# EAGLE design expansion_rxtx_rev_b (EAGLE 6.6.0)

## Sheet 1 of 3
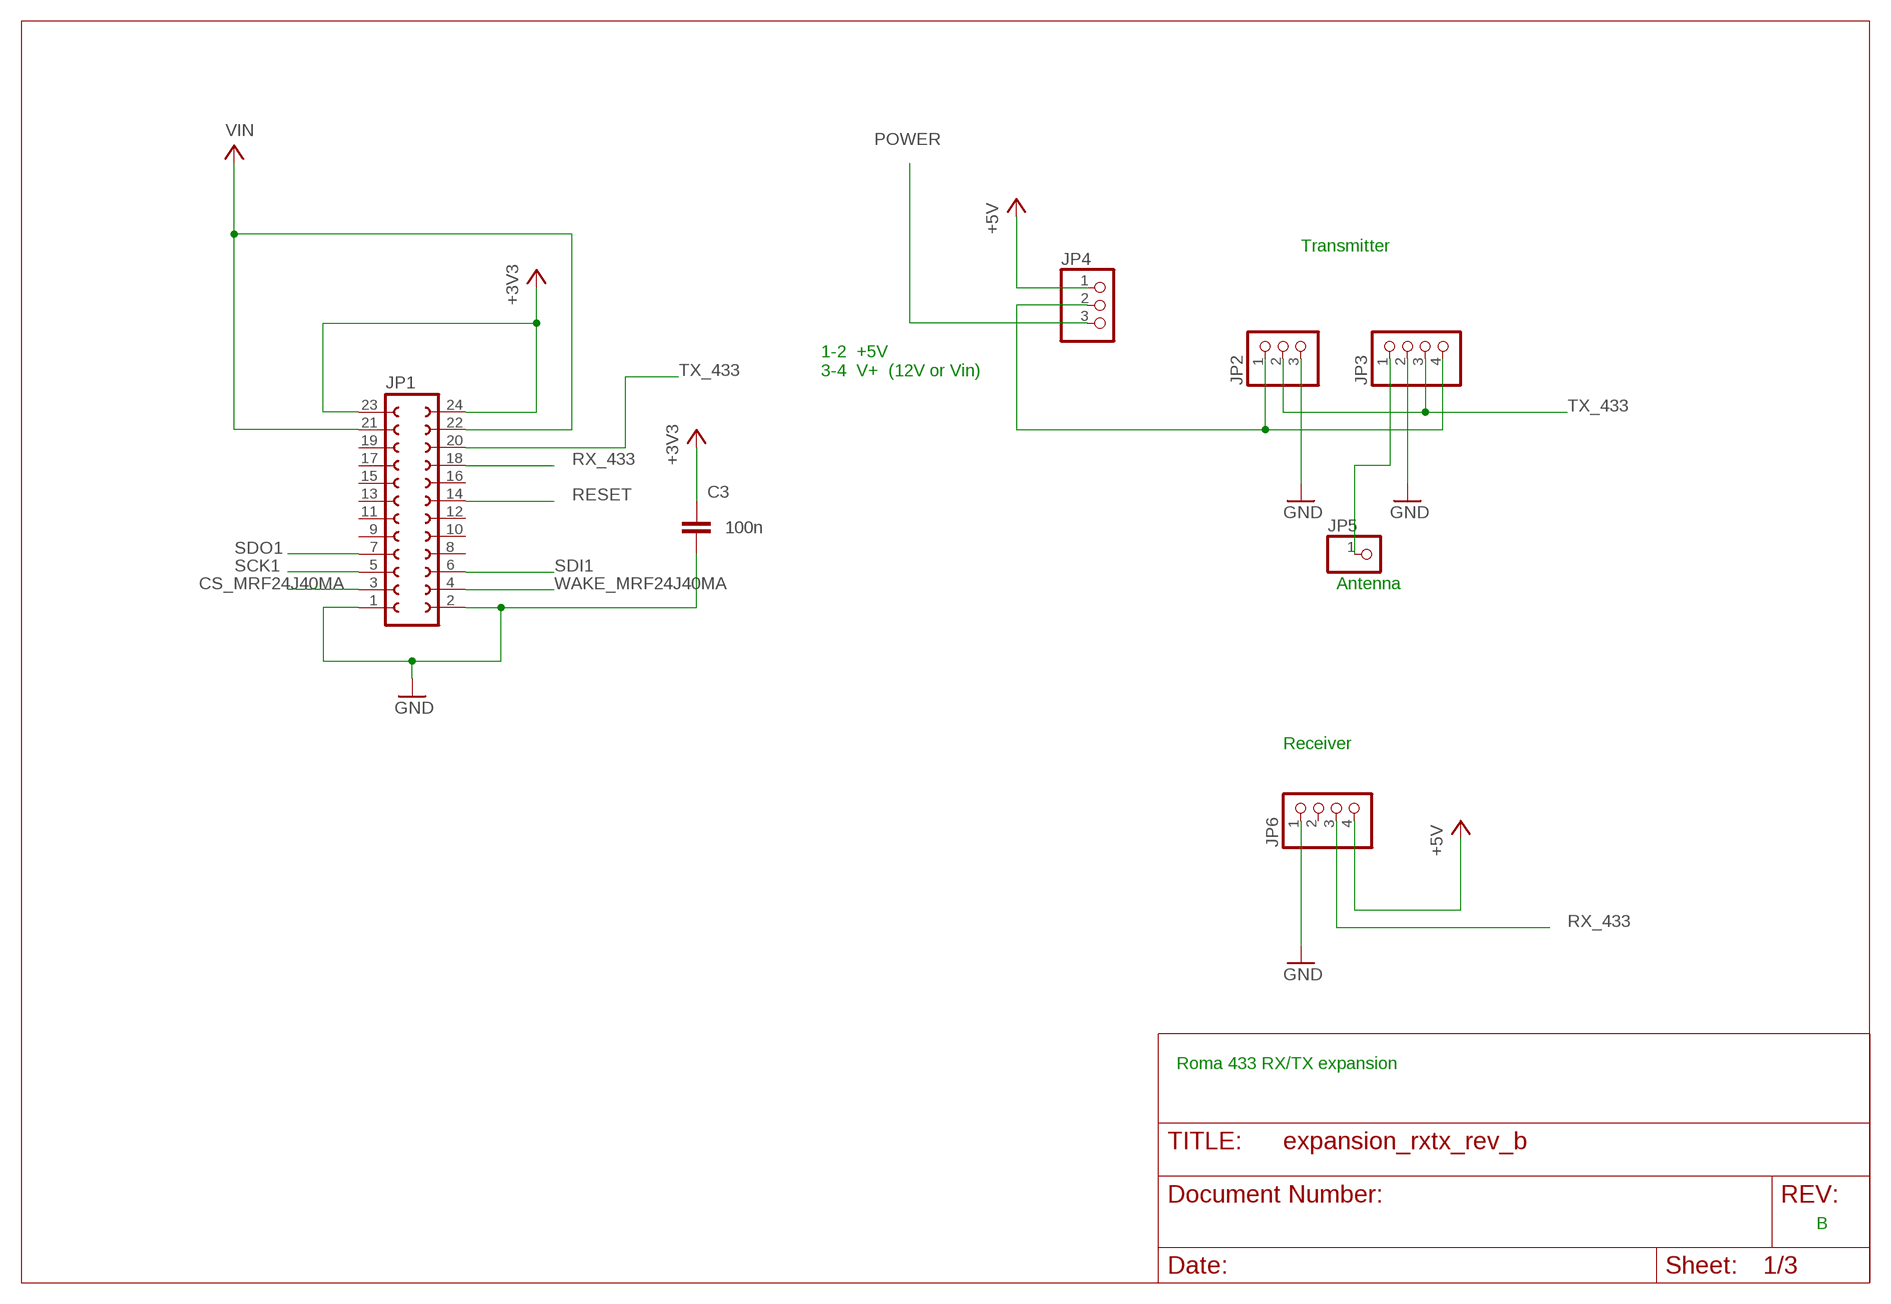
[diagram p0: schematic, sheet 1]

### Parts
C3  100n  C-EUC0805  [C0805]
JP1  FE12-2  [FE12-2]
JP2  PINHD-1X3  [1X03]
JP3  PINHD-1X4  [1X04]
JP4  PINHD-1X3  [1X03]
JP5  PINHD-1X1  [1X01]
JP6  PINHD-1X4  [1X04]

### Nets
+3V3: C3.1 JP1.23 JP1.24 ; also sheet 2,3
+5V: JP4.1 JP6.4 ; also sheet 2
CS_MRF24J40MA: JP1.3 ; also sheet 3
GND: C3.2 JP1.1 JP1.2 JP2.3 JP3.2 JP6.1 ; also sheet 2,3
N$4: JP2.1 JP3.4 JP4.2
N$33: JP3.1 JP5.1
POWER: JP4.3 ; also sheet 2
RESET: JP1.14 ; also sheet 3
RX_433: JP1.18 JP6.3 ; also sheet 3
SCK1: JP1.5 ; also sheet 3
SDI1: JP1.6 ; also sheet 3
SDO1: JP1.7 ; also sheet 3
TX_433: JP1.20 JP2.2 JP3.3
VIN: JP1.21 JP1.22 ; also sheet 2
WAKE_MRF24J40MA: JP1.4 ; also sheet 3
Unconnected: JP1.8 JP1.9 JP1.10 JP1.11 JP1.12 JP1.13 JP1.15 JP1.16 JP1.17 JP1.19 JP6.2

### Notes on the sheet
- Transmitter
- 1-2  +5V
  3-4  V+  (12V or Vin)
- Antenna
- Receiver
- Roma 433 RX/TX expansion
- B

## Sheet 2 of 3
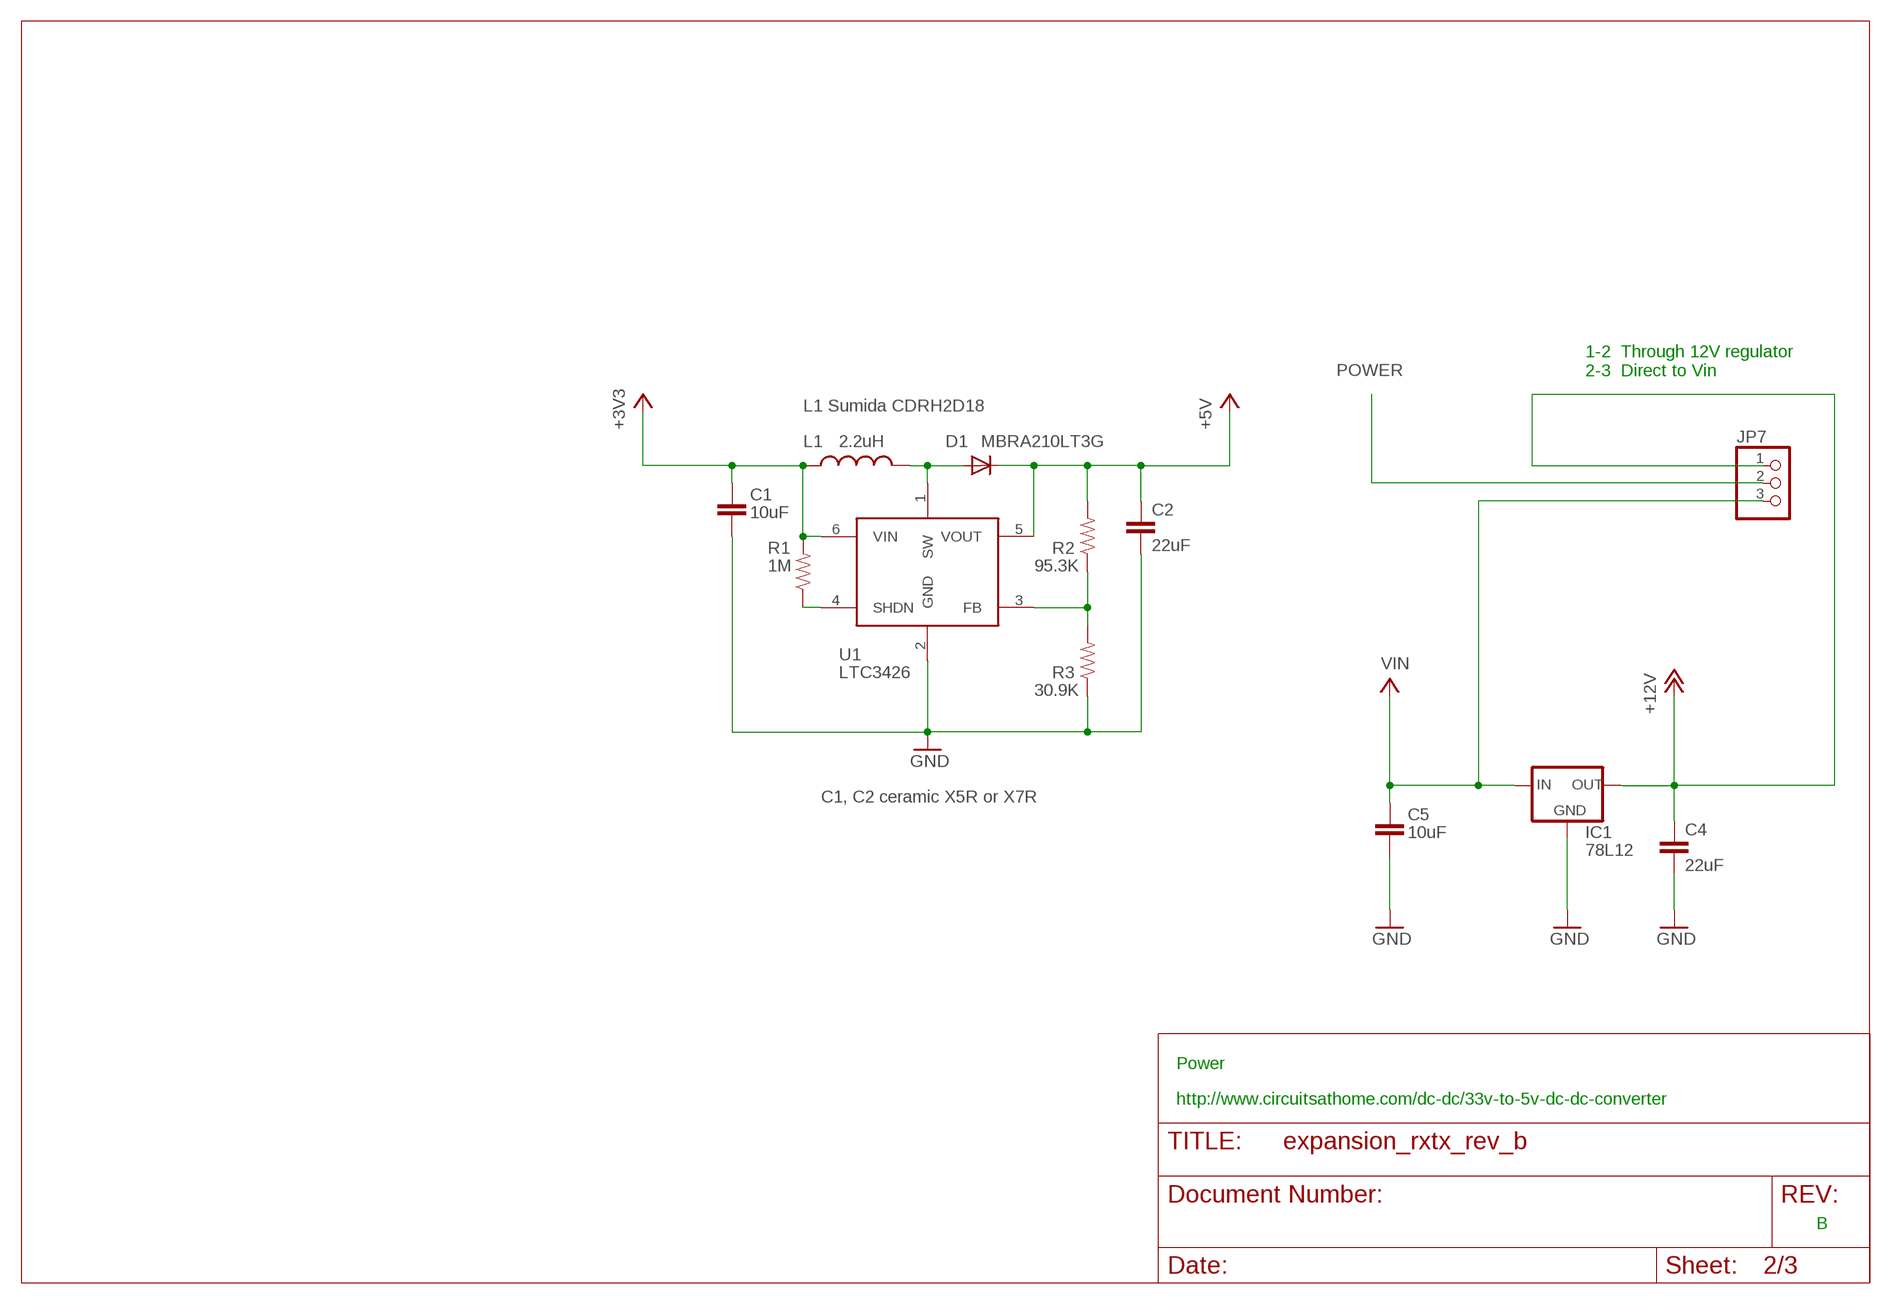
[diagram p1: schematic, sheet 2]

### Parts
C1  10uF  CAP1210  [1210]
C2  22uF  CAP1210  [1210]
C4  22uF  CAP1210  [1210]
C5  10uF  CAP1210  [1210]
D1  MBRA210LT3G  DIODESMA  [SMA-DIODE]
IC1  78L12  78LXX  [78LXX]
JP7  PINHD-1X3  [1X03]
L1  2.2uH  INDUCTOR1313  [1_3X1_3]
R1  1M  RESISTOR0805  [0805]
R2  95.3K  RESISTOR0805  [0805]
R3  30.9K  RESISTOR0805  [0805]
U1  LTC3426  [SOT23-6]

### Nets
+3V3: C1.1 L1.P$1 R1.2 U1.6(VIN) ; also sheet 1,3
+5V: C2.1 D1.C R2.2 U1.5(VOUT) ; also sheet 1
+12V: C4.1 IC1.OUT JP7.1
GND: C1.2 C2.2 C4.2 C5.2 IC1.GND R3.1 U1.2(GND) ; also sheet 1,3
N$2: D1.A L1.P$2 U1.1(SW)
N$3: R1.1 U1.4(SHDN)
N$28: R2.1 R3.2 U1.3(FB)
POWER: JP7.2 ; also sheet 1
VIN: C5.1 IC1.IN JP7.3 ; also sheet 1

### Notes on the sheet
- 1-2  Through 12V regulator
  2-3  Direct to Vin
- L1 Sumida CDRH2D18
- C1, C2 ceramic X5R or X7R
- Power
- http://www.circuitsathome.com/dc-dc/33v-to-5v-dc-dc-converter
- B

## Sheet 3 of 3
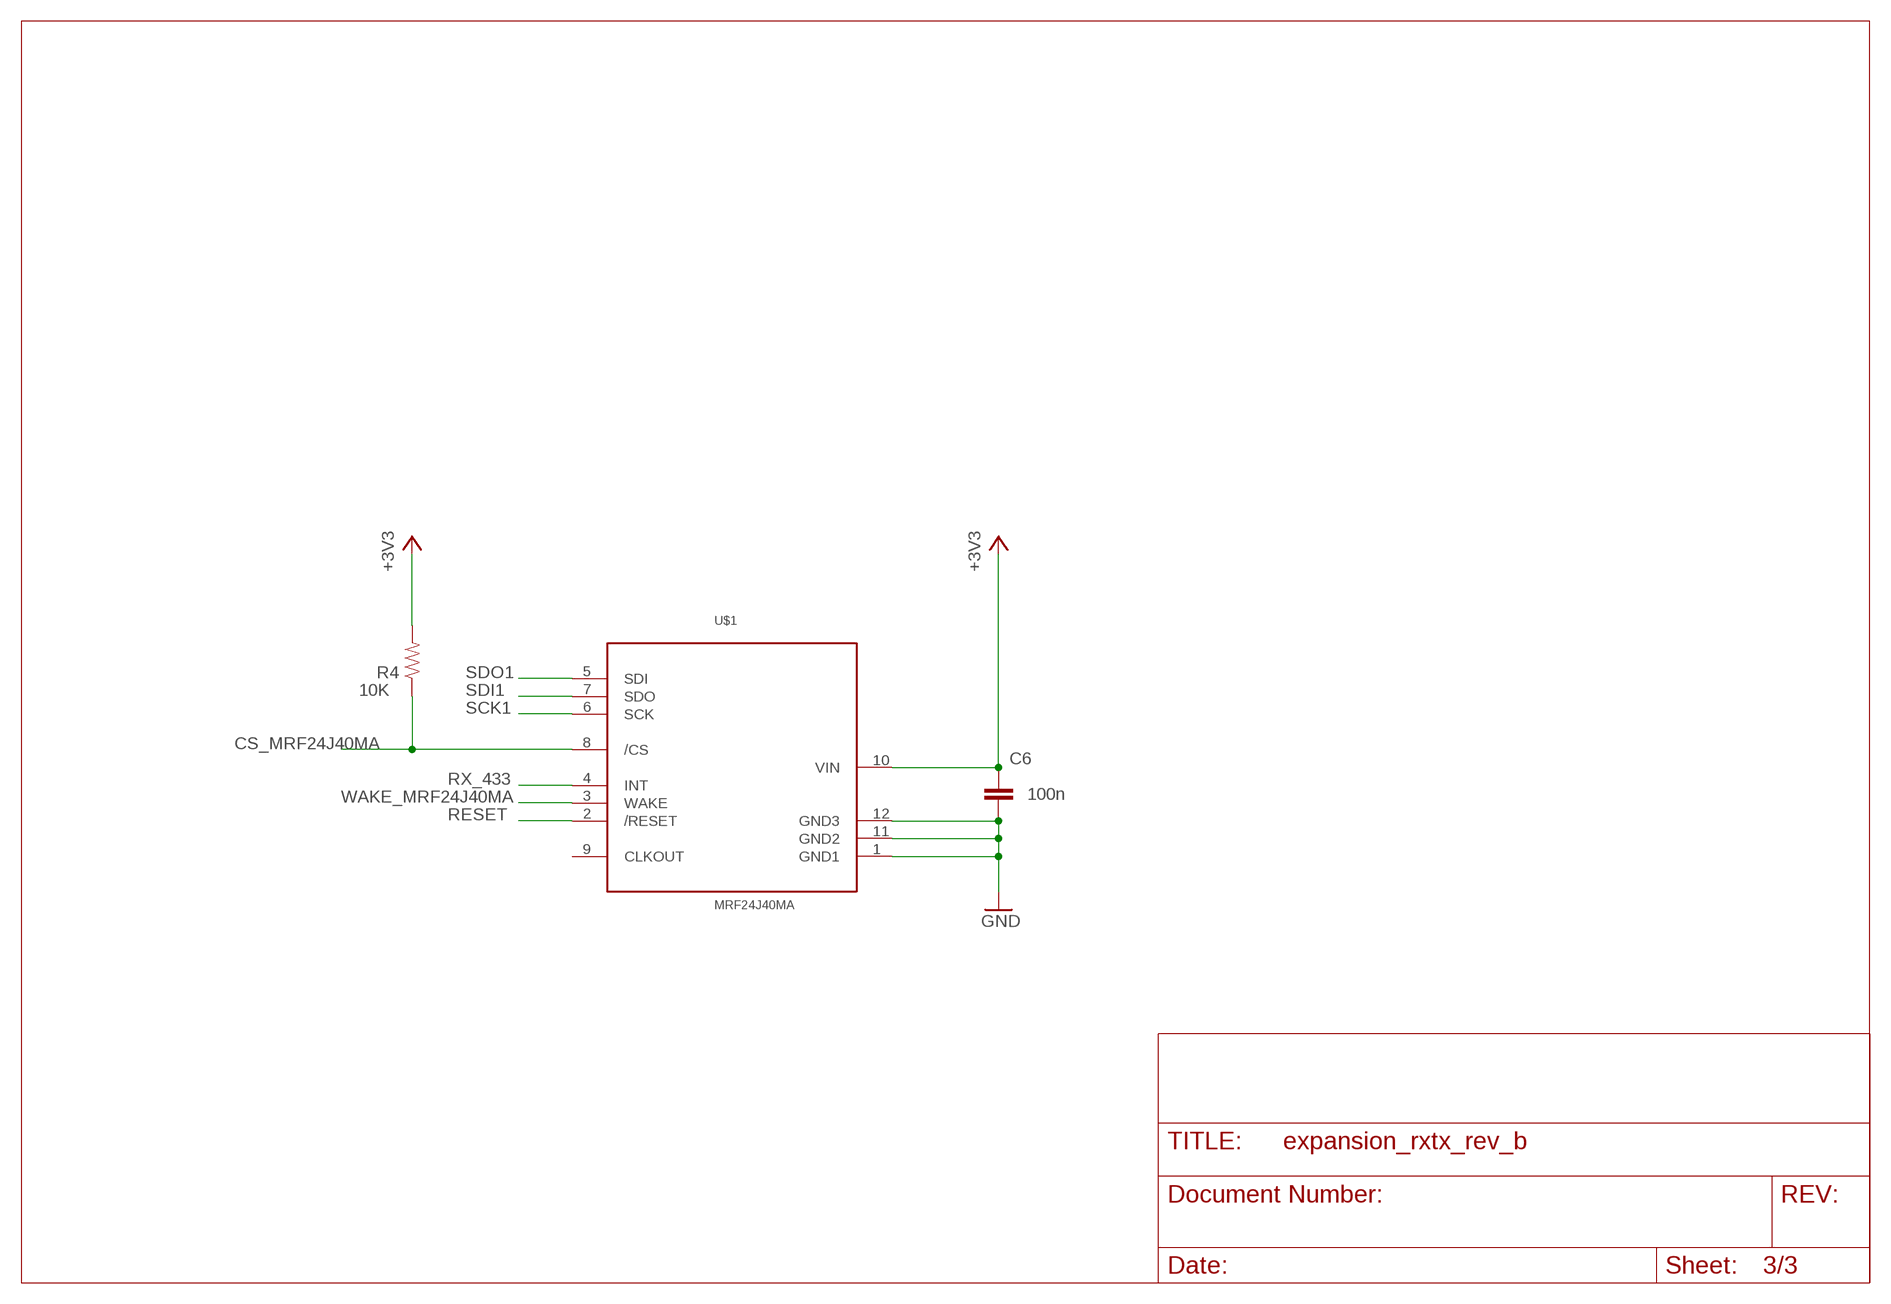
[diagram p2: schematic, sheet 3]

### Parts
C6  100n  C-EUC0805  [C0805]
R4  10K  RESISTOR0805  [0805]
U$1  MRF24J40MA  [MRF24J40MA]

### Nets
+3V3: C6.1 R4.2 U$1.10(VIN) ; also sheet 1,2
CS_MRF24J40MA: R4.1 U$1.8(/CS) ; also sheet 1
GND: C6.2 U$1.1(GND1) U$1.11(GND2) U$1.12(GND3) ; also sheet 1,2
RESET: U$1.2(/RESET) ; also sheet 1
RX_433: U$1.4(INT) ; also sheet 1
SCK1: U$1.6(SCK) ; also sheet 1
SDI1: U$1.7(SDO) ; also sheet 1
SDO1: U$1.5(SDI) ; also sheet 1
WAKE_MRF24J40MA: U$1.3(WAKE) ; also sheet 1
Unconnected: U$1.9(CLKOUT)

## Library data of the parts
C1 C2 C4 C5 = CH_passive:CAP: Capacitor Standard 0603 ceramic capacitor, and 0.1" leaded capacitor.
C3 C6 = rcl:C-EU: CAPACITOR, European symbol
D1 = CH_semiconductors:DIODE: Diode These are standard reverse protection diodes and small signal diodes. SMA package can handle up to about 1A. SOD-323 can handle about 200mA. What the SOD-323 package when ordering, there are some mfgs out there that are 5-pin packages.
IC1 = v-reg:78LXX: VOLTAGE REGULATOR
JP1 = con-lsta:FE12-2: FEMALE HEADER; OC_FARNELL: unknown; OC_NEWARK: unknown
JP2 JP4 JP7 = pinhead:PINHD-1X3: PIN HEADER
JP3 JP6 = pinhead:PINHD-1X4: PIN HEADER
JP5 = pinhead:PINHD-1X1: PIN HEADER
L1 = CH_passive:INDUCTOR: Inductors Basic Inductor/Choke - 0603 and 1206. Footprints are not proven and vary greatly between part numbers.
R1-R4 = CH_passive:RESISTOR: Resistor Basic schematic elements and footprints for 0603, 1206, and PTH 1/10th watt (small) resistors.
U1 = CH_Linear_technology:LTC3426
U$1 = eurosource_mrf24j40ma:MRF24J40MA

## Board
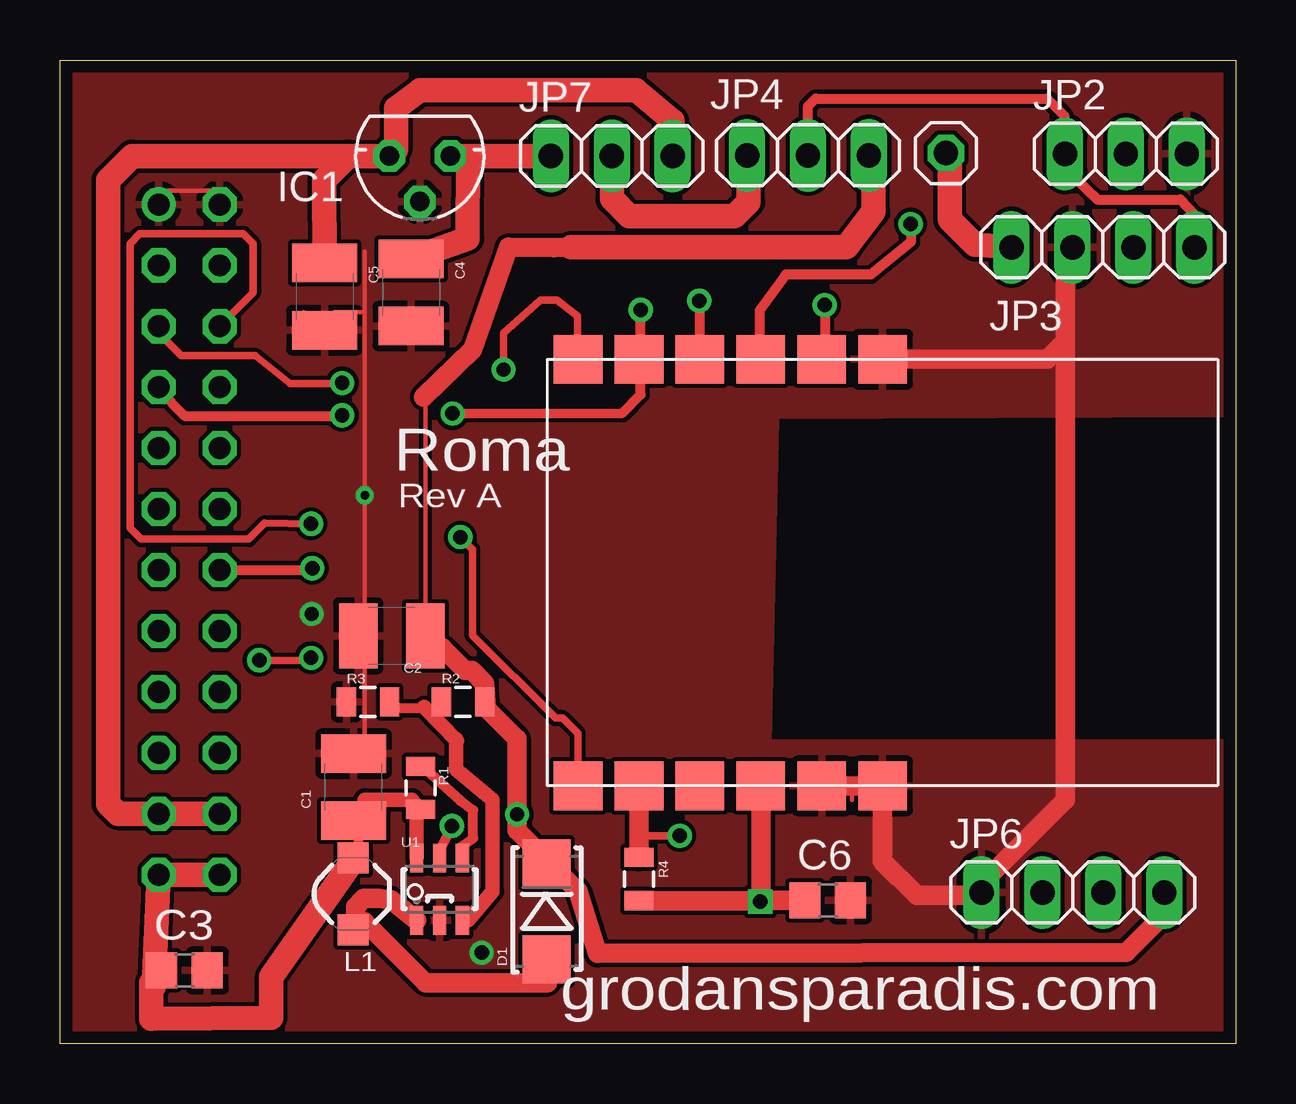
[diagram p3: board, top side]
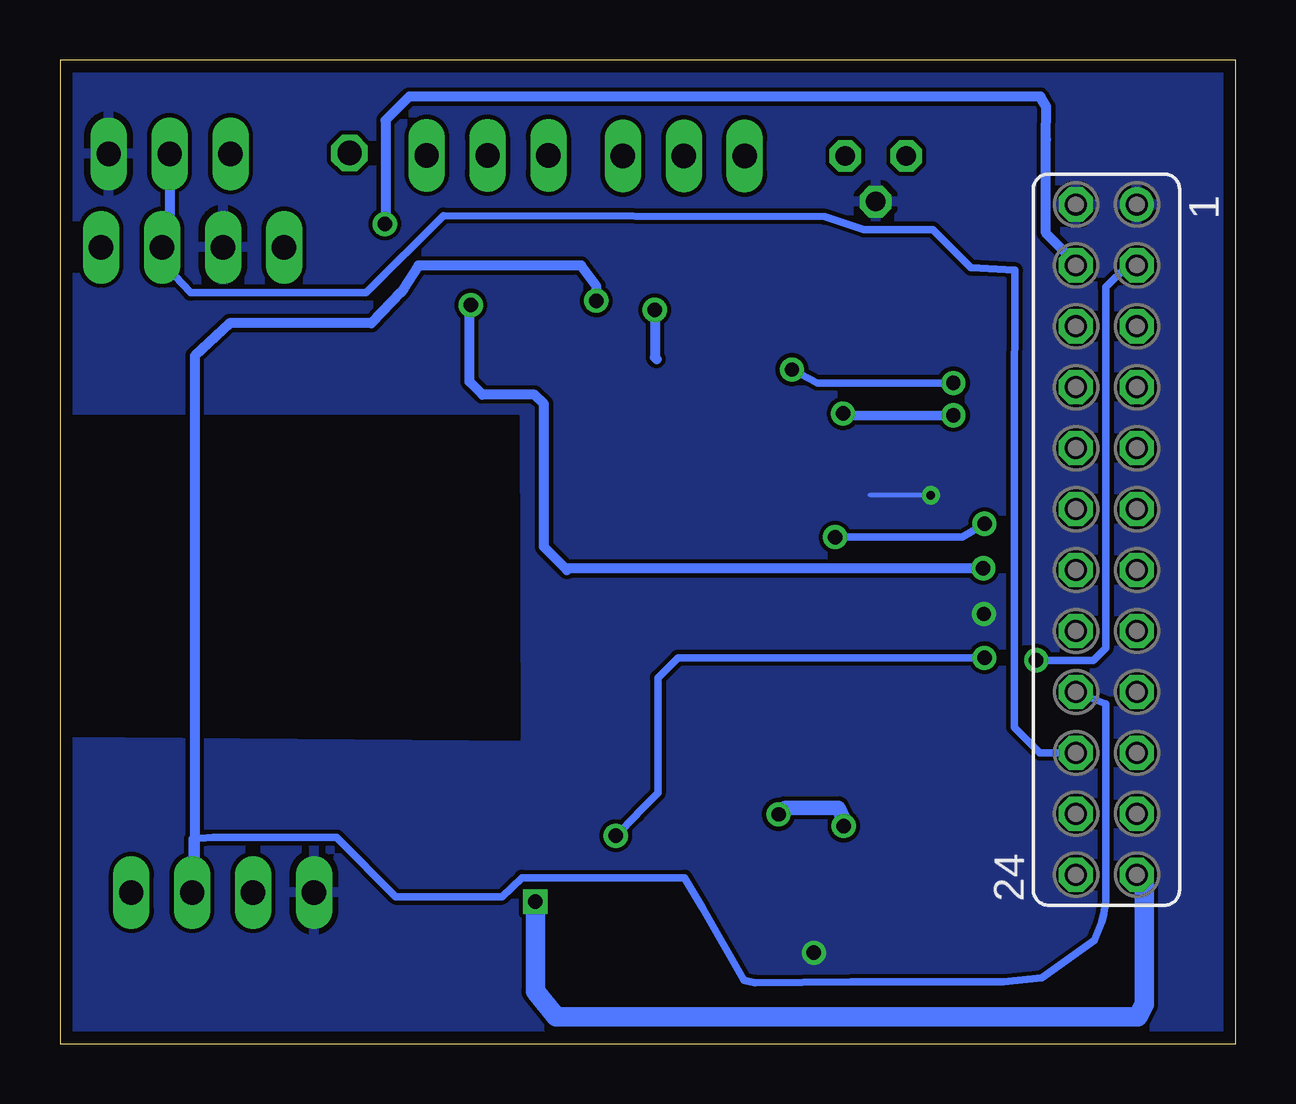
[diagram p4: board, bottom side, seen from below]

Size 49 x 41 mm. Coordinates in mm from the lower left corner, seen from the top.
Outline: 0,0 0,41 49,41 49,0 0,0
Copper layers (1*16): Top 0.0356mm / dielectric 1.5011mm / Bottom 0.0356mm
Design rules "SilverCircuits": minimum track width 7mil, minimum drill 14mil, track to track 7mil, track to pad 7mil, pad to pad 7mil, via to via 7mil, smd to smd 0mil, copper to edge 20mil, drill to drill 8mil, minimum pad ring 10mil, minimum via ring 8mil, stop-mask expansion 4mil, vias tented up to drill 0mil, thermal gap 10mil

### Footprints (pad centres in the part's own frame; a part is rotated, then mirrored left to right if it is on the bottom)
1210 = smd 1.6 x 2.7: 1 -1.4,0; 2 1.4,0
C0805 = smd 1.3 x 1.5: 1 -0.95,0; 2 0.95,0
SMA-DIODE = smd 2 x 2: A -2,0; C 2,0
78LXX = drill 0.813 octagon: GND 0,1.905; IN 1.27,0; OUT -1.27,0
FE12-2 = drill 0.914: 1 -13.97,1.27 | drill 0.914 octagon: 2 -13.97,-1.27; 3 -11.43,1.27; 4 -11.43,-1.27; 5 -8.89,1.27; 6 -8.89,-1.27; 7 -6.35,1.27; 8 -6.35,-1.27; 9 -3.81,1.27; 10 -3.81,-1.27; 11 -1.27,1.27; 12 -1.27,-1.27; 13 1.27,1.27; 14 1.27,-1.27; 15 3.81,1.27; 16 3.81,-1.27; 17 6.35,1.27; 18 6.35,-1.27; 19 8.89,1.27; 20 8.89,-1.27; 21 11.43,1.27; 22 11.43,-1.27; 23 13.97,1.27; 24 13.97,-1.27
1X03 = drill 1.016 long: 1 -2.54,0; 2 0,0; 3 2.54,0
1X04 = drill 1.016 long: 1 -3.81,0; 2 -1.27,0; 3 1.27,0; 4 3.81,0
1X01 = drill 1.016 octagon: 1 0,0
1_3X1_3 = smd 1.3 x 1.3: P$1 -1.5,0; P$2 1.5,0
0805 = smd 0.8 x 1.2: 1 -0.9,0; 2 0.9,0
SOT23-6 = smd 0.55 x 1.2: 1 -0.95,-1.3; 2 0,-1.3; 3 0.95,-1.3; 4 0.95,1.3; 5 0,1.3; 6 -0.95,1.3
MRF24J40MA = smd 2.032 x 2.032: 1 -8.89,6.35; 2 -8.89,3.81; 3 -8.89,1.27; 4 -8.89,-1.27; 5 -8.89,-3.81; 6 -8.89,-6.35; 7 8.89,-6.35; 8 8.89,-3.81; 9 8.89,-1.27; 10 8.89,1.27; 11 8.89,3.81; 12 8.89,6.35

### Placement (x,y rotation side)
C1  12.24,10.68 90 top
C2  13.83,16.99 180 top
C3  5.19,3.05 0 top
C4  14.63,31.31 270 top
C5  11.03,31.14 270 top
C6  32,5.97 0 top
D1  20.29,5.52 90 top
IC1  15,37 180 top
JP1  5.38,21.01 270 bottom
JP2  44.43,37.09 0 top
JP3  43.48,33.19 0 top
JP4  31.18,37.02 180 top
JP5  36.93,37.12 0 top
JP6  42.22,6.3 0 top
JP7  23,37 0 top
L1  12.22,6.24 270 top
R1  15.03,10.65 270 top
R2  16.8,14.24 0 top
R3  12.84,14.24 0 top
R4  24.13,6.86 270 top
U1  15.82,6.43 0 top
U$1  27.94,19.63 270 top

### Tracks (layer width: path | path; a pad name or v marks a point on that pad's centre or on a via)
+3V3  (via drill 0.6)
  Top 0.178: 12.7,10.16 C1.1 | C3.1 3.81,2.54
  Top 0.406: 12.37,7.85 12.7,10.16 | 3.81,2.54 3.91,2.36
  Top 0.61: 12.7,10.16 14.68,10.16 R1.2 14.87,9.65 U1.6
  Top 0.813: U$1.10 29.21,5.94 v29.18,5.92 | C6.1 29.23,5.97 v29.18,5.92 | R4.2 29.14,5.96 v29.18,5.92
  Top 1.016: 3.81,2.54 3.81,1.04 8.8,1.06 8.81,2.79 12.37,7.85 L1.P$1 | 3.91,2.36 JP1.23 JP1.24
  Bottom 0.813: v29.18,5.92 29.18,2.18 28.32,1.12 4.06,1.12 3.81,1.63 3.81,6.74 JP1.23
+5V  (via drill 0.6)
  Top 0.178: 15.24,16.51 C2.1 15.24,17.78 15.24,26.67 15.16,26.95 | 17.78,13.97 R2.2 | 20.32,7.62 D1.C
  Top 0.406: 33.91,36.83 JP4.1 | 16.25,8.92 15.79,8.01 U1.5
  Top 0.61: 16.25,8.92 v16.33,9.07
  Top 0.813: 15.24,16.51 15.93,16.51 16.89,15.54 17.17,15.54 17.7,15.01 17.78,13.97 19.05,12.7 v19.05,9.55 19.05,8.89 20.32,7.62 21.59,6.35 22.4,3.76 44.45,3.81 45.72,5.08 JP6.4 | 21.31,33.2 20.6,33.17 18.69,33.2 17.2,28.93 15.16,26.95 | 15.16,16.96 C2.1
  Top 1.016: 21.31,33.2 32.79,33.2 33.91,34.67 33.91,36.83
  Bottom 0.61: v16.33,9.07 16.23,9.14 16.56,9.83 18.77,9.83 v19.05,9.55
+12V
  Top 0.406: 17,37 IC1.OUT
  Top 1.016: C4.1 16.99,33.55 17,37 | JP7.1 IC1.OUT
CS_MRF24J40MA  (via drill 0.6)
  Top 0.305: v8.31,15.98 10.36,15.98 v10.46,16.08 | v25.83,8.66 24.28,8.66 24.13,8.51
  Top 0.813: R4.1 24.13,8.51 U$1.8
  Bottom 0.305: JP1.3 4.49,32.44 5.41,31.52 5.41,16.48 5.92,15.98 v8.31,15.98 | v10.46,16.08 23.24,16.08 24.08,15.24 24.08,10.44 24.94,9.58 24.94,9.55 v25.83,8.66
GND  (via drill 0.36, 0.6)
  Top 0.178: JP1.1 3.81,35.56 6.35,35.56 JP1.2 | 12.7,30.48 v12.7,22.86 12.7,17.78 C2.2 12.7,16.51 12.7,12.7 C1.2 | 12.7,30.48 12.7,33.02 | 15.24,35.56 IC1.GND | 12.7,30.48 11.43,30.48 C5.2 10.16,30.48 | 5.99,2.54 6.35,2.54 C3.2 | 38.1,6.35 JP6.1 38.1,7.62 38.51,7.62 | U$1.11 31.75,10.16 31.9,10.59 | 33.02,10.16 33.02,10.59 | 34.14,10.9 34.29,11.43 U$1.12
  Top 0.813: 38.1,6.35 41.91,10.16 41.91,29.29 | 41.91,29.29 41.91,33.02 JP3.2 | U$1.11 U$1.12 34.29,7.59 35.71,6.17 38.29,6.17 JP6.1 | U$1.1 41.15,28.52 41.91,29.29
  Bottom 0.178: v12.7,22.86 15.24,22.86
  other vias: 10.49,17.91 17.58,3.78
  pour Top: 0.25,41.02 0.53,41.02 0.53,0.18 48.79,-0.18 48.67,12.67 48.36,12.52 29.51,12.52 29.82,26.04 29.51,26.04 29.51,26.19 48.59,26.26 48.56,40.94 0.61,41.1
  pour Bottom: 0.28,41.29 0.25,41.29 0.25,0.08 24.44,0.38 25.66,-0.03 30.07,-0.02 48.82,-0.12 48.67,12.6 29.57,12.42 29.62,26.42 48.54,26.42 48.54,26.72 48.59,26.72 48.59,28.85 48.49,40.67 30.07,41.18 0.51,41.37 0.51,40.95
N$2
  Top 0.178: L1.P$2 12.7,5.08 | 20.32,2.54 D1.A
  Top 0.406: L1.P$2 12.32,4.83
  Top 0.813: 12.7,5.08 15.24,2.54 20.32,2.54 | U1.1 13.79,5.99 13.28,6.05 12.66,6.05 12.32,5.71 12.32,4.83
N$3
  Top 0.178: R1.1 15.24,11.43 | 16.69,7.57 U1.4
  Top 0.406: 15.24,11.43 16.69,10.11 17.22,9.73 17.22,8.56 16.69,8.18 16.69,7.57
N$4
  Top 0.406: JP4.2 31.18,39.08 31.5,39.4 41.15,39.4 41.86,38.68 41.86,37.12 JP2.1 41.89,36.47 43.23,35.18 46.71,35.18 47.3,34.54 47.3,33.3 JP3.4
N$28
  Top 0.178: 13.97,13.97 R3.2 | 17.01,5.13 U1.3
  Top 0.406: 16.51,11.43 16.47,11.43 16.55,12.6 | 15.24,13.97 13.97,13.97 | 15.24,13.97 15.68,13.97 R2.1 | 16.51,12.7 15.24,13.97
  Top 0.61: 16.55,12.6 15.19,14.03 | 17.01,5.13 18.03,6.35 18.03,10.16 16.51,11.43 16.51,12.7
N$33
  Top 0.406: 37.08,36.97 JP5.1
  Top 1.016: JP3.1 38.13,33.3 37.08,34.34 37.08,36.97
POWER
  Top 0.406: 28.7,36.96 JP4.3
  Top 1.016: JP7.2 23,35.22 23.72,34.49 28.12,34.49 28.7,35.08 28.7,36.96
RESET  (via drill 0.6)
  Top 0.406: v31.88,30.79 31.88,28.65 U$1.2 | JP1.14 10.44,19.74 v10.52,19.81
  Bottom 0.406: v31.88,30.79 31.93,30.73 31.93,27.58 31.39,27.05 29.21,27.05 28.83,26.67 28.83,20.7 27.86,19.74 27.79,19.81 v10.52,19.81
RX_433  (via drill 0.6)
  Top 0.406: U$1.4 26.67,30.94 v26.64,30.96
  Bottom 0.305: JP6.3 43.49,8.53 42.62,8.59 37.47,8.59 35,6.12 30.58,6.12 29.74,6.91 22.96,6.91 22.23,5.66 20.5,2.64 20.04,2.54 16.03,2.56 9.68,2.56 8.08,2.74 5.89,4.29 5.56,5.08 5.49,5.44 5.41,5.92 5.41,14.15 JP1.18
  Bottom 0.406: v26.64,30.96 26.64,31.57 27.28,32.44 34.06,32.44 34.7,31.42 34.77,31.32 36.02,30.02 41.94,30.02 43.38,28.68 43.38,6.51 JP6.3
SCK1  (via drill 0.6)
  Top 0.305: JP1.5 4.11,29.62 5.05,28.68 8.13,28.68 9.6,27.51 11.68,27.51 v11.76,27.53 | v18.49,28.09 18.49,29.62 20.04,30.99 20.73,30.99 21.57,30.33 21.57,28.55 U$1.6
  Bottom 0.305: v11.76,27.53 17.42,27.53 v18.49,28.09
SDI1  (via drill 0.6)
  Top 0.305: U$1.7 21.59,12.93 20.95,13.56 20.65,13.56 17.2,17.02 17.2,20.6 v16.69,21.11 | v10.46,21.67 8.53,21.69 7.87,21.03 3.38,21.03 2.92,21.49 2.92,33.35 3.33,33.76 7.64,33.76 8.05,33.35 8.05,31.3 JP1.6
  Bottom 0.305: v16.69,21.11 11.38,21.11 v10.46,21.67
SDO1  (via drill 0.6)
  Top 0.178: U$1.5 24.13,29.21 24.21,29.21
  Top 0.406: JP1.7 4.11,27.26 5.21,26.16 11.73,26.16 v11.76,26.19 | v16.36,26.26 23.44,26.29 24.21,27.05 24.21,29.21 v24.21,30.58
  Bottom 0.406: v11.76,26.19 16.33,26.16 v16.36,26.26 | v24.21,30.58 24.21,28.6 U$1.5
TX_433
  Bottom 0.305: JP1.20 8.15,12.12 9.22,13.18 9.22,25.53 9.2,32.23 11.02,32.33 12.62,33.93 15.49,33.93 17.12,34.47 33.02,34.52 36.25,31.29 43.56,31.29 44.91,32.74 44.91,33.13 JP3.3
  Bottom 0.406: JP2.2 44.43,33.61 JP3.3
VIN
  Top 0.406: 14,37.27 IC1.IN
  Top 1.016: JP1.22 JP1.21 2.42,9.58 2,10 2,36 3,37 12,37 | 12,37 IC1.IN | C5.1 11,36 12,37 | JP7.3 25.54,38.46 24,39.75 15,39.75 14,39 14,37.27
WAKE_MRF24J40MA  (via drill 0.6)
  Top 0.406: v35.46,34.16 35.46,33.4 33.81,32.05 30.25,32.05 29.16,30.56 29.16,28.57 U$1.3
  Bottom 0.406: JP1.4 6.65,32.53 7.9,33.78 7.9,37.69 7.89,39.06 8.13,39.47 34.44,39.47 35.43,38.48 35.43,34.19 v35.46,34.16

### Text on the board
tNames: Roma | Rev A | grodansparadis.com